# EAGLE design arduino-tutorial (EAGLE 5.08)
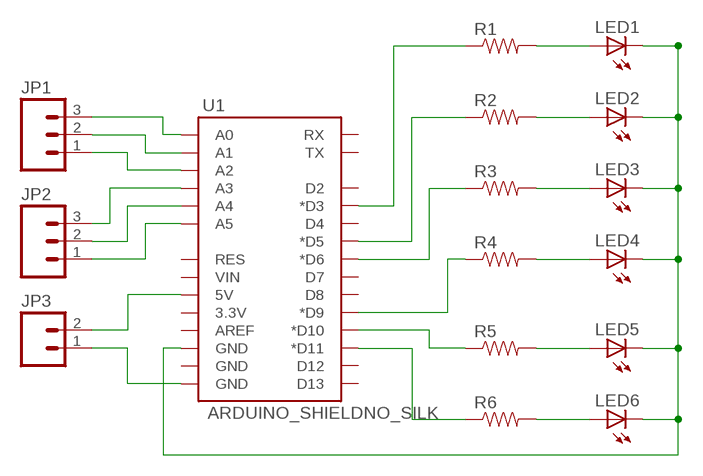
[diagram p0: schematic, sheet 1]

## Parts
JP1  M03SCREW  [SCREWTERMINAL-3.5MM-3]
JP2  M03SCREW  [SCREWTERMINAL-3.5MM-3]
JP3  M023.5MM  [SCREWTERMINAL-3.5MM-2]
LED1  LED5MM  [LED5MM]
LED2  LED5MM  [LED5MM]
LED3  LED5MM  [LED5MM]
LED4  LED5MM  [LED5MM]
LED5  LED5MM  [LED5MM]
LED6  LED5MM  [LED5MM]
R1  RESISTORPTH1  [AXIAL-0.3]
R2  RESISTORPTH1  [AXIAL-0.3]
R3  RESISTORPTH1  [AXIAL-0.3]
R4  RESISTORPTH1  [AXIAL-0.3]
R5  RESISTORPTH1  [AXIAL-0.3]
R6  RESISTORPTH1  [AXIAL-0.3]
U1  ARDUINO_SHIELDNO_SILK  [DUEMILANOVE_VIAS]

## Nets
N$1: JP1.3 U1.A0
N$2: JP1.2 U1.A1
N$3: JP1.1 U1.A2
N$4: JP2.3 U1.A3
N$5: JP2.2 U1.A4
N$6: JP2.1 U1.A5
N$7: JP3.2 U1.5V
N$8: JP3.1 U1.GND@0(GND)
N$9: R1.P$1 U1.D3(*D3)
N$10: R2.P$1 U1.D5(*D5)
N$11: R3.P$1 U1.D6(*D6)
N$12: R4.P$1 U1.D9(*D9)
N$13: R5.P$1 U1.D10(*D10)
N$14: R6.P$1 U1.D11(*D11)
N$15: LED1.A R1.P$2
N$16: LED2.A R2.P$2
N$17: LED3.A R3.P$2
N$18: LED4.A R4.P$2
N$19: LED5.A R5.P$2
N$20: LED6.A R6.P$2
N$21: LED1.K(C) LED2.K(C) LED3.K(C) LED4.K(C) LED5.K(C) LED6.K(C) U1.GND@2(GND)
Unconnected: U1.3.3V U1.AREF U1.D2 U1.D4 U1.D7 U1.D8 U1.D12 U1.D13 U1.GND@1(GND) U1.RES U1.RX U1.TX U1.VIN

## Library data of the parts
JP1 JP2 = SparkFun:M03: Header 3 Standard 3-pin 0.1" header. Use with straight break away headers (SKU : PRT-00116), right angle break away headers (PRT-00553), swiss pins (PRT-00743), machine pins (PRT-00117), and female headers (PRT-00115). Molex polarized connector foot print use with SKU : PRT-08232 with associated crimp pins and housings.
JP3 = SparkFun:M02: Header 2 Standard 2-pin 0.1" header. Use with straight break away headers (SKU : PRT-00116), right angle break away headers (PRT-00553), swiss pins (PRT-00743), machine pins (PRT-00117), and female headers (PRT-00115). Molex polarized connector foot print use with SKU : PRT-08233 with associated crimp pins and housings.
LED1-LED6 = SparkFun:LED: LEDs Standard schematic elements and footprints for 5mm, 3mm, 1206, and 0603 sized LEDs. 5mm - Spark Fun Electronics SKU : COM-00529 (and others)
R1-R6 = SparkFun:RESISTOR: Resistor Basic schematic elements and footprints for 0603, 1206, and PTH 1/10th watt (small) resistors.
U1 = SparkFun:ARDUINO_SHIELD

## Board
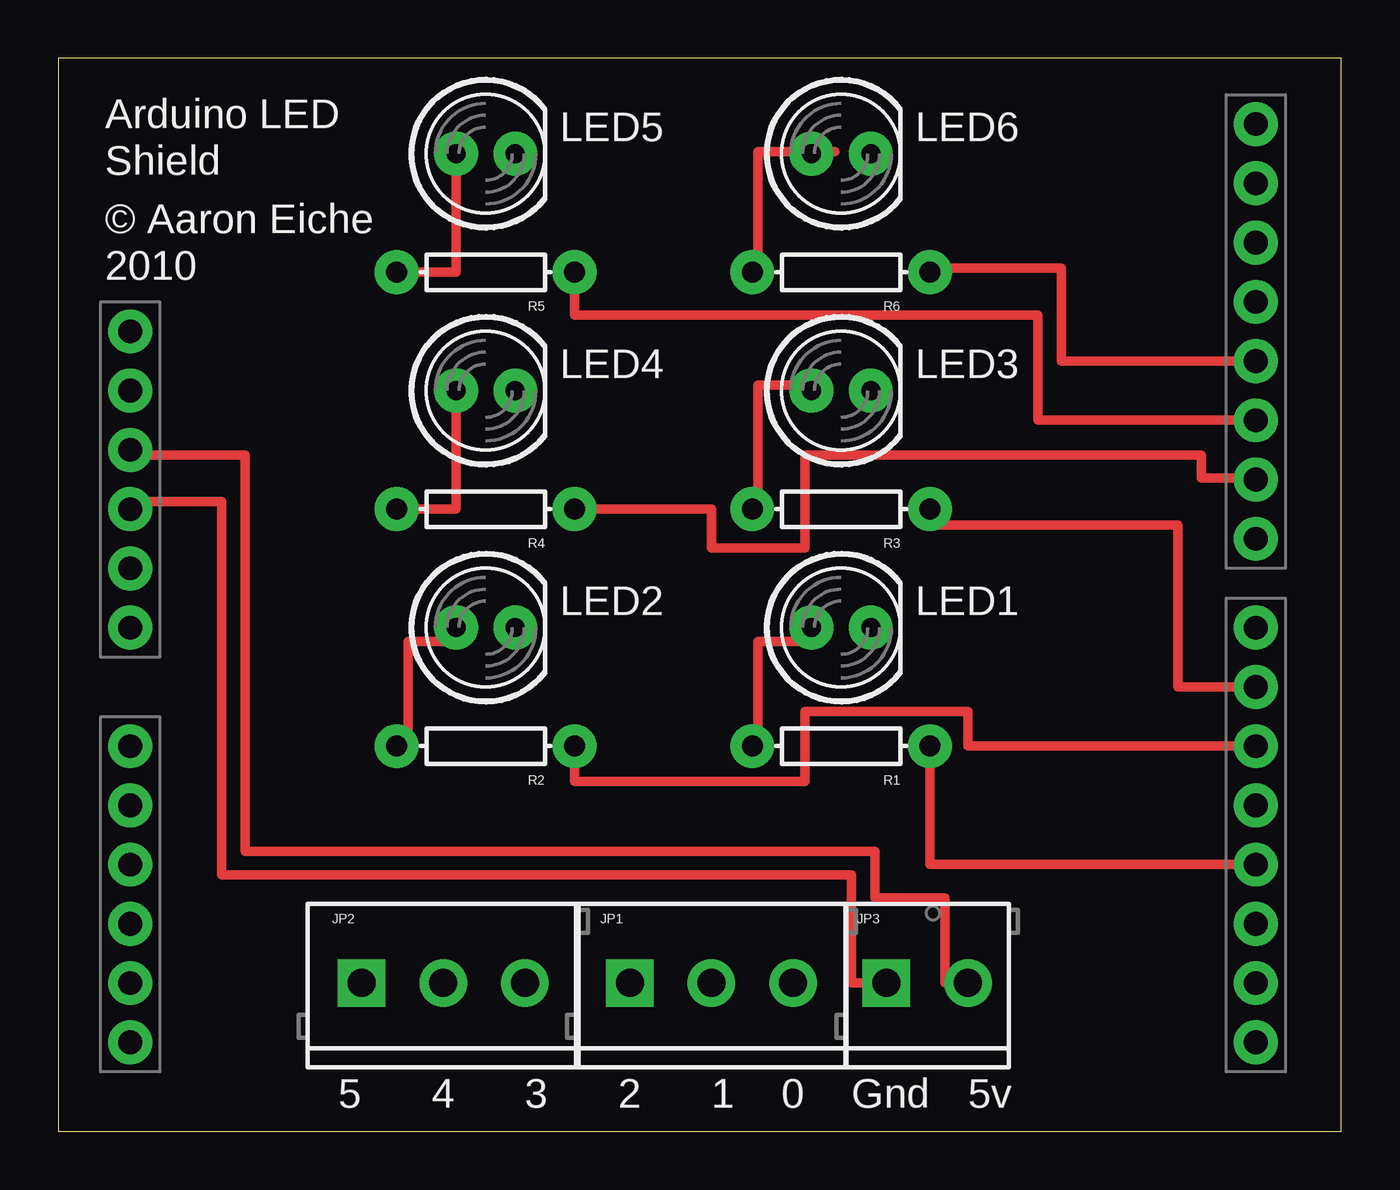
[diagram p1: board, top side]
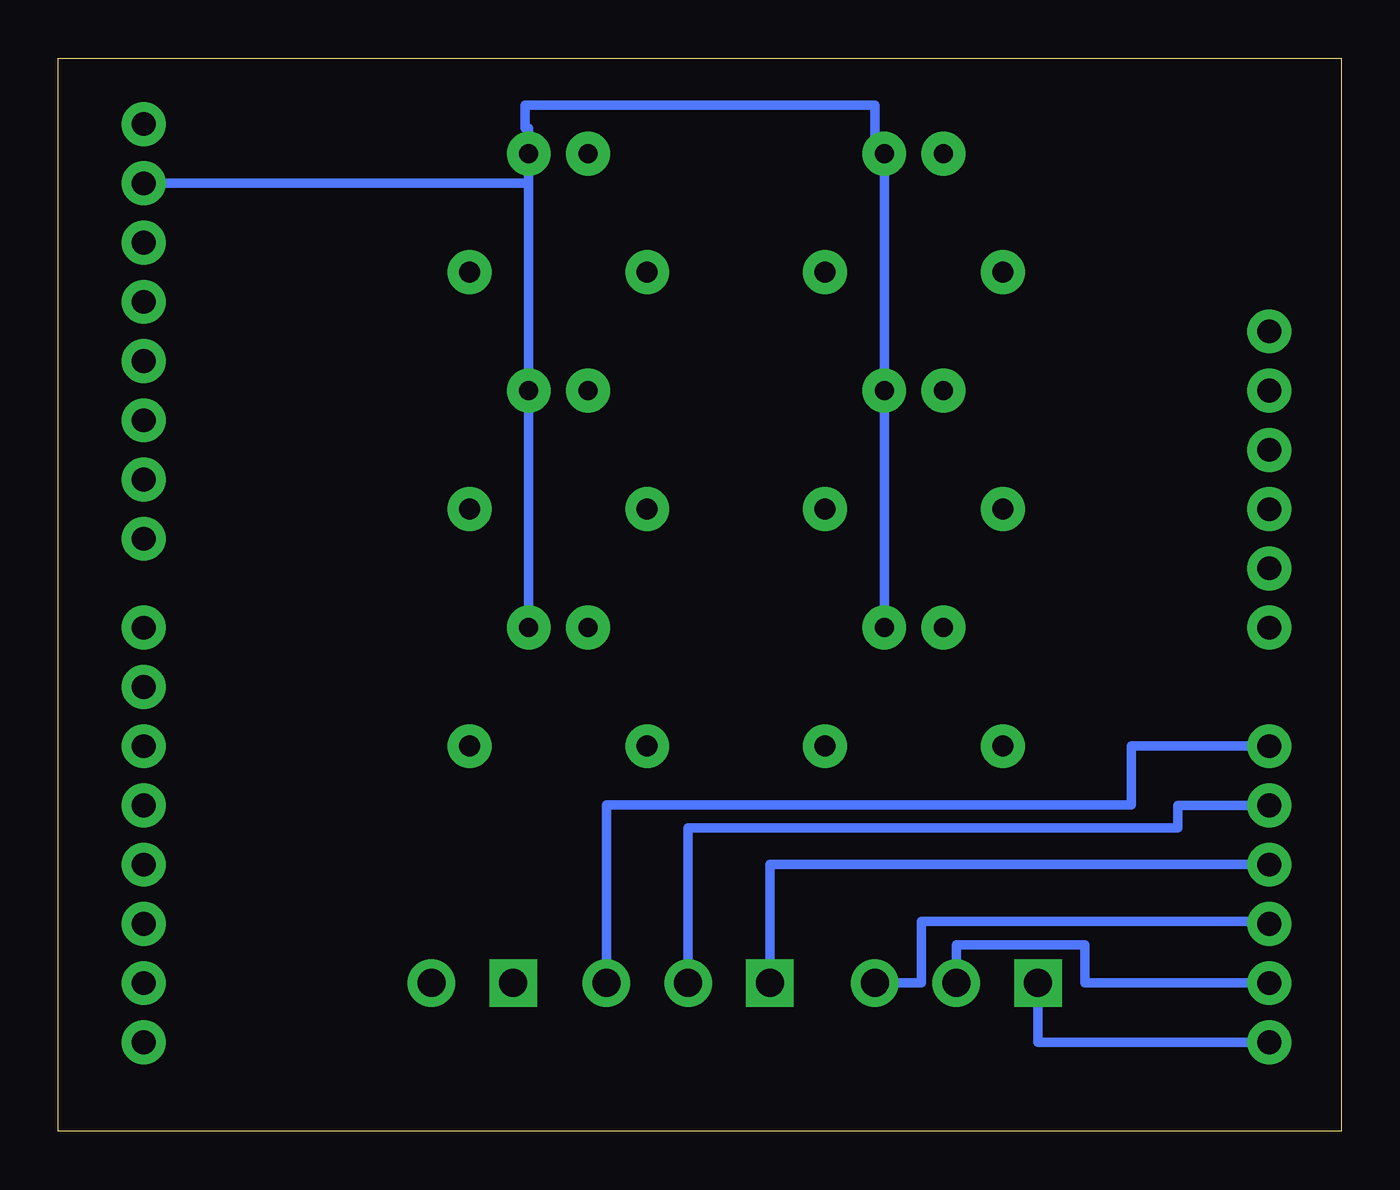
[diagram p2: board, bottom side, seen from below]

Size 55 x 46 mm. Coordinates in mm from the lower left corner, seen from the top.
Outline: 0,0 55,0 55,46 0,46 0,0
Copper layers (1*16): Top 0.0356mm / dielectric 1.5011mm / Bottom 0.0356mm
Design rules "LaenPCBOrder": minimum track width 6mil, minimum drill 13mil, track to track 6mil, track to pad 6mil, pad to pad 6mil, via to via 6mil, smd to smd 6mil, copper to edge 15mil, drill to drill 6mil, minimum pad ring 7mil, minimum via ring 7mil, stop-mask expansion 4mil, vias tented up to drill 0mil, thermal gap 10mil

### Footprints (pad centres in the part's own frame; a part is rotated, then mirrored left to right if it is on the bottom)
SCREWTERMINAL-3.5MM-3 = drill 1.2 pad 2.032 square: 1 0,0 | drill 1.2 pad 2.032 round: 2 3.5,0; 3 7,0
SCREWTERMINAL-3.5MM-2 = drill 1.2 pad 2.032 square: 1 0,0 | drill 1.2 pad 2.032 round: 2 3.5,0
LED5MM = drill 0.813 pad 1.88 round: A -1.27,0; K 1.27,0
AXIAL-0.3 = drill 0.9 pad 1.88 round: P$1 -3.81,0; P$2 3.81,0
DUEMILANOVE_VIAS = drill 1.016 pad 1.88 round: 3.3V 50.8,13.97; 5V 50.8,16.51; A0 50.8,29.21; A1 50.8,31.75; A2 50.8,34.29; A3 50.8,36.83; A4 50.8,39.37; A5 50.8,41.91; AREF 2.54,2.54; D2 2.54,36.83; D3 2.54,34.29; D4 2.54,31.75; D5 2.54,29.21; D6 2.54,26.67; D7 2.54,24.13; D8 2.54,20.32; D9 2.54,17.78; D10 2.54,15.24; D11 2.54,12.7; D12 2.54,10.16; D13 2.54,7.62; GND@0 50.8,19.05; GND@1 50.8,21.59; GND@2 2.54,5.08; RES 50.8,11.43; RX 2.54,41.91; TX 2.54,39.37; VIN 50.8,24.13

### Placement (x,y rotation side)
JP1  24.5,6.35 0 top
JP2  13,6.35 0 top
JP3  35.5,6.35 0 top
LED1  33.56,21.59 0 top
LED2  18.32,21.59 0 top
LED3  33.56,31.75 0 top
LED4  18.32,31.75 0 top
LED5  18.32,41.91 0 top
LED6  33.56,41.91 0 top
R1  33.56,16.51 180 top
R2  18.32,16.51 180 top
R3  33.56,26.67 180 top
R4  18.32,26.67 180 top
R5  18.32,36.83 180 top
R6  33.56,36.83 180 top
U1  53.88,45.72 180 top

### Tracks (layer width: path | path; a pad name or v marks a point on that pad's centre or on a via)
N$1
  Bottom 0.406: U1.A0 9,16.51 9,14 31.5,14 JP1.3
N$2
  Bottom 0.406: U1.A1 7,13.97 7,13 28,13 JP1.2
N$3
  Bottom 0.406: U1.A2 24.5,11.43 JP1.1
N$4
  Bottom 0.406: JP2.3 18,6.35 18,9 3.08,9 U1.A3
N$5
  Bottom 0.406: U1.A4 11,6.35 11,8 16.5,8 JP2.2
N$6
  Bottom 0.406: U1.A5 13,3.81 JP2.1
N$7
  Top 0.406: JP3.2 38,6.35 38,10 35,10 35,12 8,12 8,29 3.08,29 | 3.08,29 3,29 | 3.08,29 U1.5V
N$8
  Top 0.406: JP3.1 34,6.35 34,11 7,11 7,27 3.08,27 U1.GND@0
N$9
  Top 0.406: U1.D3 37.37,11.43 R1.P$1
N$10
  Top 0.406: U1.D5 39,16.51 39,18 32,18 32,15 22.13,15 R2.P$1
N$11
  Top 0.406: U1.D6 48,19.05 48,26 37.37,26 R3.P$1
N$12
  Top 0.406: R4.P$1 28,26.67 28,25 32,25 32,29 49,29 49,28 51.34,28 U1.D9
N$13
  Top 0.406: U1.D10 42,30.48 42,35 22.13,35 R5.P$1
N$14
  Top 0.406: U1.D11 43,33.02 43,37 37.37,37 R6.P$1
N$15
  Top 0.406: R1.P$2 30,16.51 30,21 32.29,21 LED1.A
N$16
  Top 0.406: R2.P$2 15,16.51 15,21 17.05,21 LED2.A
N$17
  Top 0.406: R3.P$2 30,26.67 30,32 33,32 33,31.75 LED3.A
N$18
  Top 0.406: R4.P$2 17.05,26.67 LED4.A
N$19
  Top 0.406: R5.P$2 17.05,36.83 LED5.A
N$20
  Top 0.406: R6.P$2 30,36.83 30,42 33.29,42 LED6.A
N$21
  Bottom 0.406: 34.83,40.64 U1.GND@2 | 34.83,40.64 LED6.K 34.83,43 35,43 35,44 20,44 20,41.91 LED5.K LED4.K LED2.K | 34.83,40.64 LED3.K LED1.K

### Text on the board
tPlace: Arduino LED | Shield | © Aaron Eiche | 2010 | 5 | 4 | 3 | 2 | 1 | 0 | Gnd | 5v